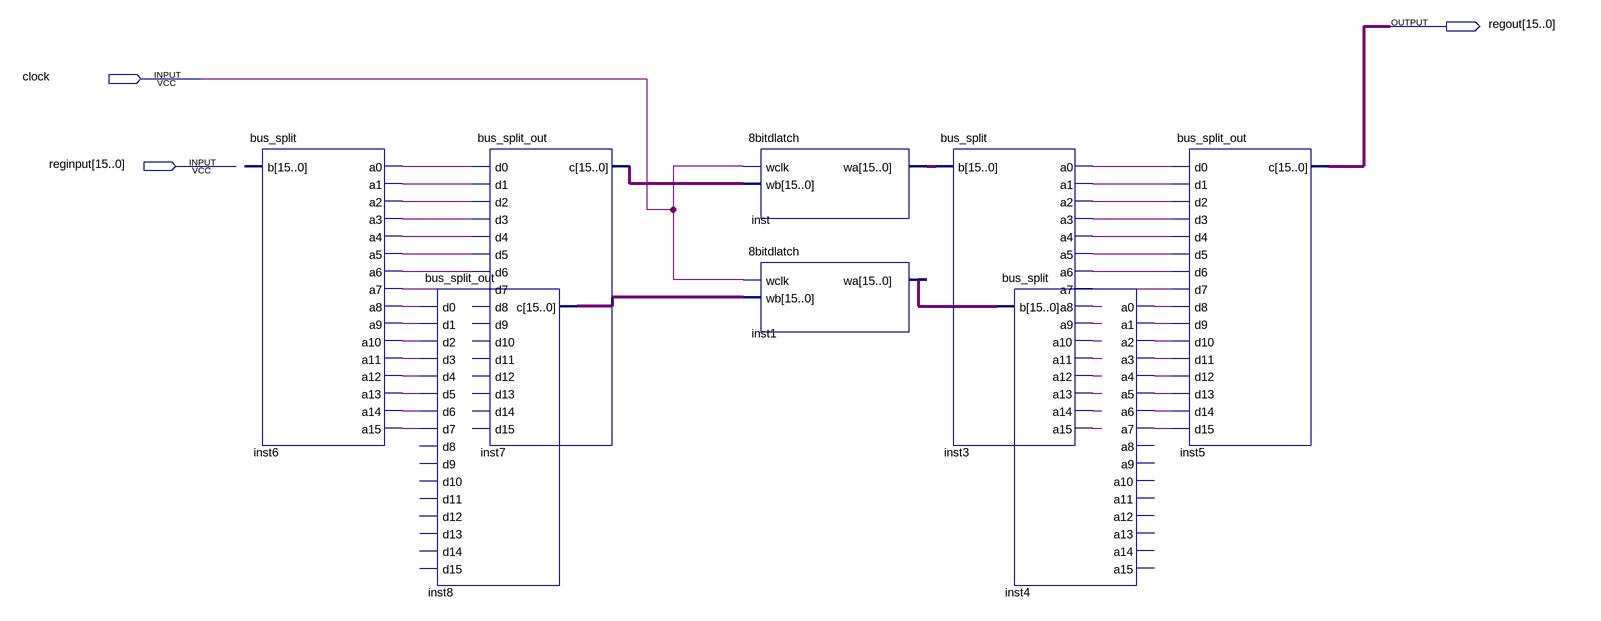
[diagram p0: schematic sheet]
// Quartus schematic b16bit_latch.bdf as structural Verilog: 8 symbols, 3 pins
module b16bit_latch (
  input  clock,
  input  [15:0] reginput,
  output [15:0] regout
);

  wire inst3_a0, inst3_a1, inst3_a2, inst3_a3, inst3_a4, inst3_a5, inst3_a6, inst3_a7, inst3_a8, inst3_a9,
       inst3_a10, inst3_a11, inst3_a12, inst3_a13, inst3_a14, inst3_a15, inst4_a0, inst4_a1, inst4_a2,
       inst4_a3, inst4_a4, inst4_a5, inst4_a6, inst4_a7, inst6_a0, inst6_a1, inst6_a2, inst6_a3, inst6_a4,
       inst6_a5, inst6_a6, inst6_a7, inst6_a8, inst6_a9, inst6_a10, inst6_a11, inst6_a12, inst6_a13,
       inst6_a14, inst6_a15;
  wire [15:0] inst1_wa, inst7_c, inst8_c, inst_wa;

  bus_split inst6 (
    .a0(inst6_a0), .a1(inst6_a1), .a2(inst6_a2), .a3(inst6_a3), .a4(inst6_a4), .a5(inst6_a5), .a6(inst6_a6),
    .a7(inst6_a7), .a8(inst6_a8), .a9(inst6_a9), .a10(inst6_a10), .a11(inst6_a11), .a12(inst6_a12),
    .a13(inst6_a13), .a14(inst6_a14), .a15(inst6_a15));  // open: b
  bus_split_out inst7 (
    .d0(inst6_a0), .d1(inst6_a1), .d2(inst6_a2), .d3(inst6_a3), .d4(inst6_a4), .d5(inst6_a5), .d6(inst6_a6),
    .d7(inst6_a7), .c(inst7_c));  // open: d8, d9, d10, d11, d12, d13, d14, d15
  bus_split_out inst8 (
    .d0(inst6_a8), .d1(inst6_a9), .d2(inst6_a10), .d3(inst6_a11), .d4(inst6_a12), .d5(inst6_a13),
    .d6(inst6_a14), .d7(inst6_a15), .c(inst8_c));  // open: d8, d9, d10, d11, d12, d13, d14, d15
  \8bitdlatch  inst (.wclk(clock), .wb(inst7_c), .wa(inst_wa));
  \8bitdlatch  inst1 (.wclk(clock), .wb(inst8_c), .wa(inst1_wa));
  bus_split inst3 (
    .b(inst_wa), .a0(inst3_a0), .a1(inst3_a1), .a2(inst3_a2), .a3(inst3_a3), .a4(inst3_a4), .a5(inst3_a5),
    .a6(inst3_a6), .a7(inst3_a7), .a8(inst3_a8), .a9(inst3_a9), .a10(inst3_a10), .a11(inst3_a11),
    .a12(inst3_a12), .a13(inst3_a13), .a14(inst3_a14), .a15(inst3_a15));
  bus_split inst4 (
    .b(inst1_wa), .a0(inst4_a0), .a1(inst4_a1), .a2(inst4_a2), .a3(inst4_a3), .a4(inst4_a4), .a5(inst4_a5),
    .a6(inst4_a6), .a7(inst4_a7));  // open: a8, a9, a10, a11, a12, a13, a14, a15
  bus_split_out inst5 (
    .d0(inst3_a0), .d1(inst3_a1), .d2(inst3_a2), .d3(inst3_a3), .d4(inst3_a4), .d5(inst3_a5), .d6(inst3_a6),
    .d7(inst3_a7), .d8(inst4_a0), .d9(inst4_a1), .d10(inst4_a2), .d11(inst4_a3), .d12(inst4_a4),
    .d13(inst4_a5), .d14(inst4_a6), .d15(inst4_a7), .c(regout));
endmodule
